# EAGLE schematic SMARTBALL_v3 WIP (EAGLE 9.6.2)
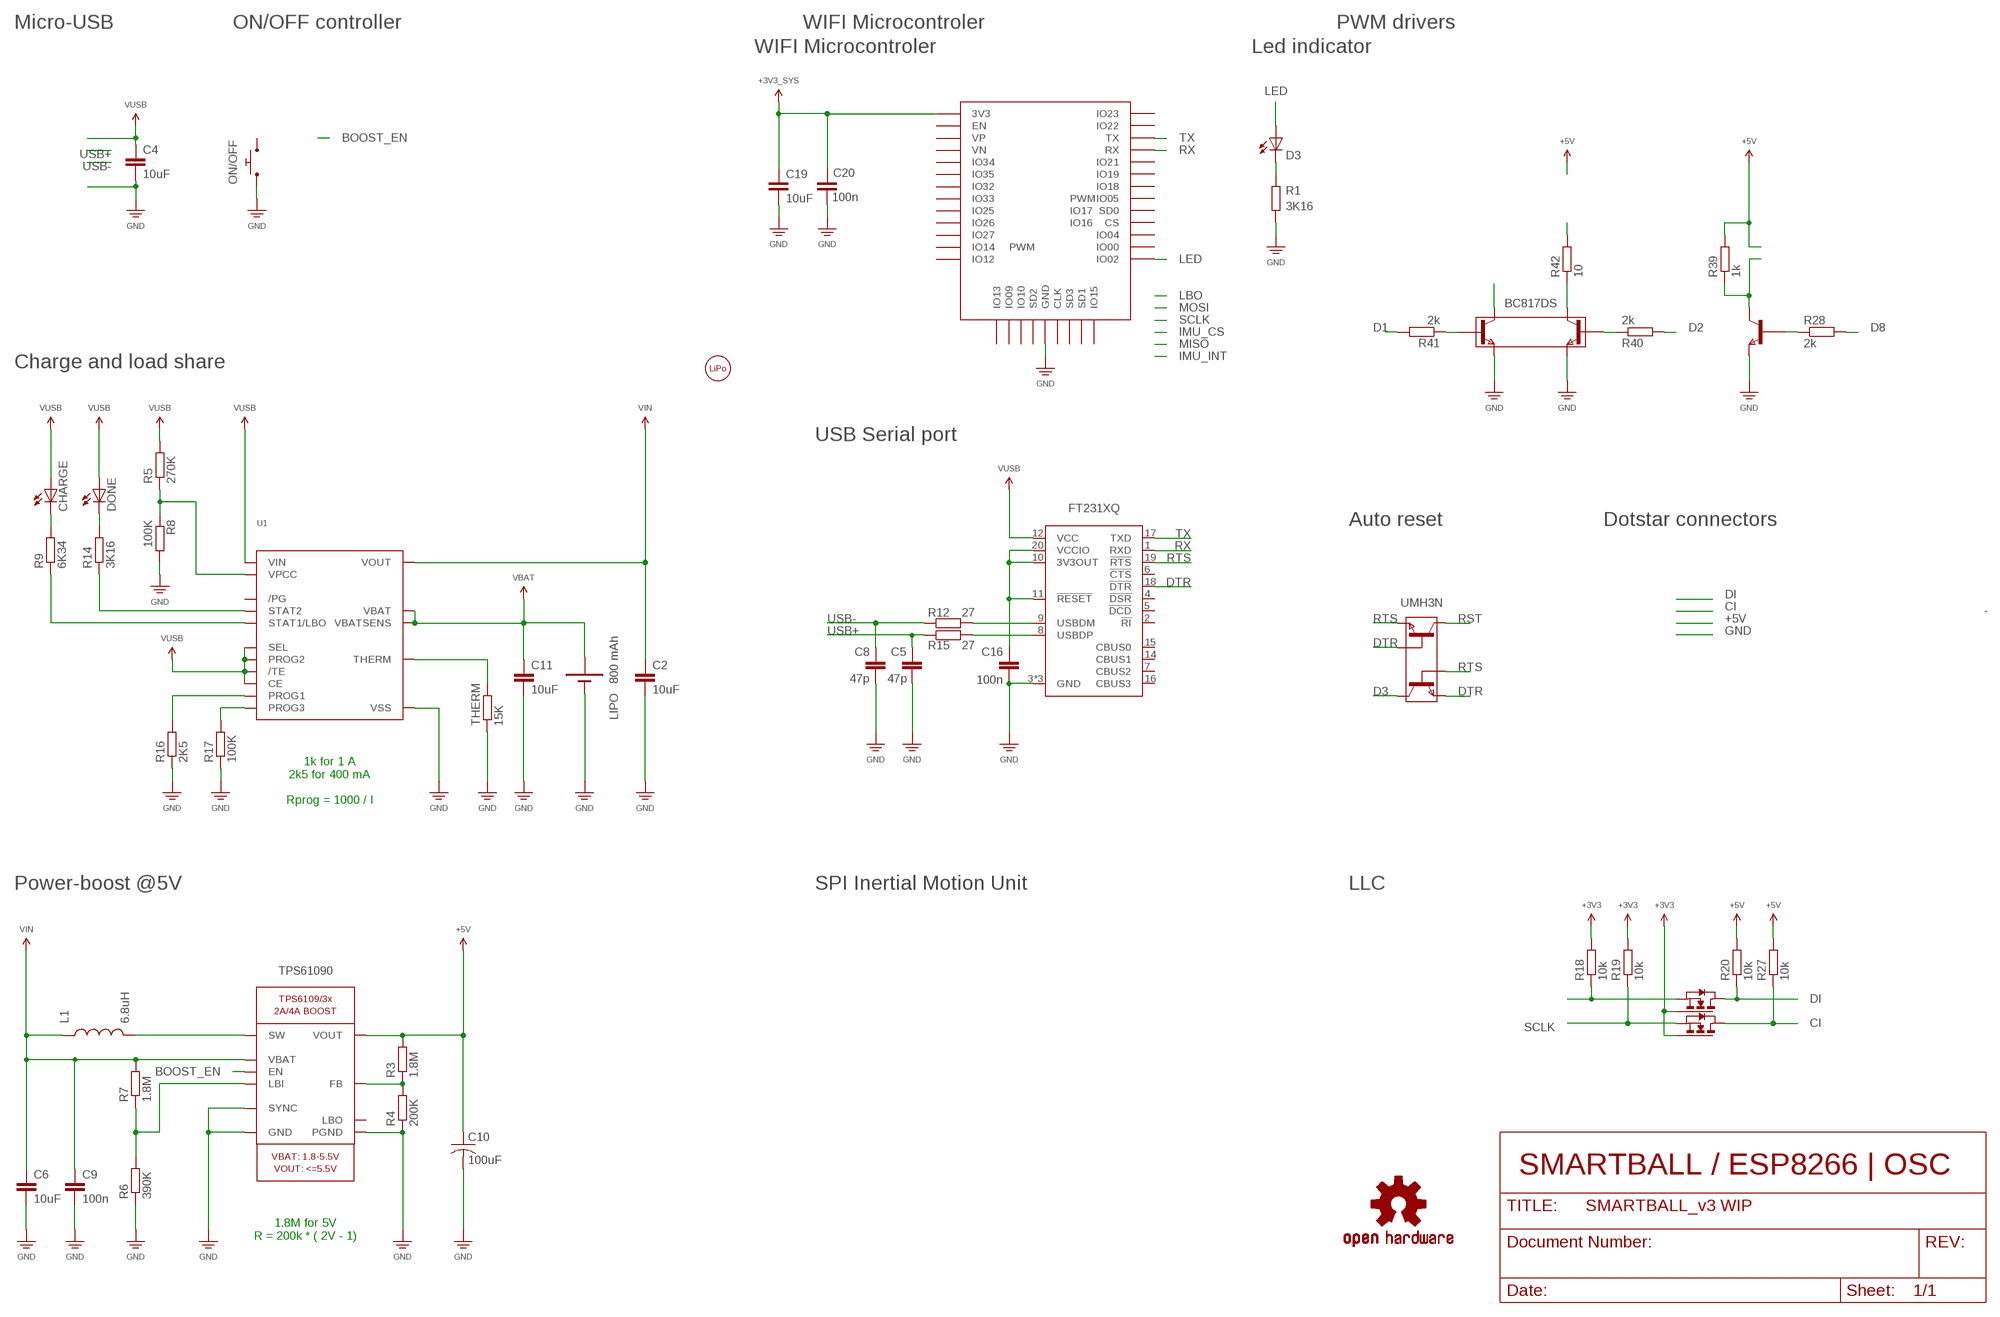
[diagram p0: schematic, sheet 1]

## Parts
BC817DS  SOT_BC817DS  [SOT457R_PHILIPS]
C2  10uF  CAP_CERAMICC0603K  [C0603]
C4  10uF  CAP_CERAMICC0603K  [C0603]
C5  47p  CAP_CERAMICC0603K  [C0603]
C6  10uF  CAP_CERAMICC0603K  [C0603]
C8  47p  CAP_CERAMICC0603K  [C0603]
C9  100n  CAP_CERAMICC0603K  [C0603]
C10  100uF  CAP_TANTALUMC1210  [C1210]
C11  10uF  CAP_CERAMICC0603K  [C0603]
C16  100n  CAP_CERAMICC0603K  [C0603]
C19  10uF  C-EUC0603  [C0603]
C20  100n  C-EUC0603  [C0603]
CHARGE  LED_KINGBRIGHT_16X08  [LED_KINGBRIGHT_16X08]
D3  Blue  LED_KINGBRIGHT_16X08  [LED_KINGBRIGHT_16X08]
DONE  LED_KINGBRIGHT_16X08  [LED_KINGBRIGHT_16X08]
FT231XQ  QFN_FT231X  [QFN20]
L1  6.8uH  IND_ASPIAIG-S4035  [IND_ASPIAIG-S4035]
LIPO  CONN_BATTERY  [CONN_WIRES]
LOGO1  LOGO_OSHWL  [LOGO_OSHW]
ON/OFF  BUT_KMR6  [BUT_KMR6]
R1  3K16  RES_EUR0402  [R0402]
R3  1.8M  RES_EUR0402  [R0402]
R4  200K  RES_EUR0402  [R0402]
R5  270K  RES_EUR0402  [R0402]
R6  390K  RES_EUR0402  [R0402]
R7  1.8M  RES_EUR0402  [R0402]
R8  100K  RES_EUR0402  [R0402]
R9  6K34  RES_EUR0402  [R0402]
R12  27  RES_EUR0402  [R0402]
R14  3K16  RES_EUR0402  [R0402]
R15  27  RES_EUR0402  [R0402]
R16  2K5  RES_EUR0402  [R0402]
R17  100K  RES_EUR0402  [R0402]
R18  10k  RES_EUR0402  [R0402]
R19  10k  RES_EUR0402  [R0402]
R20  10k  RES_EUR0402  [R0402]
R27  10k  RES_EUR0402  [R0402]
R28  2k  RES_EUR0402  [R0402]
R39  1k  RES_EUR0402  [R0402]
R40  2k  RES_EUR0402  [R0402]
R41  2k  RES_EUR0402  [R0402]
R42  10  RES_EUR0402  [R0402]
THERM  15K  RES_EUR0402  [R0402]
TPS61090  TPS61090RSAR  QFN_TPS6103X  [QFN16]
U1  QFN_MCP73871  [QFN20]
U6  ESP-MICRO32  [ESP-MICRO32]
U$22  SOT_2N7002PS  [SOT363]
U$28  SOT_SBC847AWT1G  [SOT323]
U$29  BATT_BODY  [BATT_BODY]
UMH3N  SOT_UMH3N  [SOT363]

## Nets
+3V3 [+3v3]: R18.2 R19.2 U$22.2(G1) U$22.5(G2)
+3V3_SYS [power]: C19.1 C20.1 U6.2(3V3)
+5V [power]: C10.1 R3.2 R20.2 R27.2 R39.2 TPS61090.1(VOUT) TPS61090.15(VOUT) TPS61090.16(VOUT)
B1: BC817DS.5(B2) R41.1
B2: BC817DS.2(B1) R40.1
B3: R28.1 U$28.1(B)
BOOST_EN [power]: TPS61090.11(EN)
C1: BC817DS.3(C2)
C2: BC817DS.6(C1) R42.1
C3: R39.1 U$28.3(C)
CI: R27.1 U$22.3(D2)
D1: R41.2
D2: R40.2
D3: UMH3N.3(C2)
D8: R28.2
DI: R20.1 U$22.6(D1)
DTR: FT231XQ.18(!DTR) UMH3N.2(B1) UMH3N.4(E2)
FB: R3.1 R4.2 TPS61090.14(FB)
GND [power]: BC817DS.1(E1) BC817DS.4(E2) C2.2 C4.2 C5.2 C6.2 C8.2 C9.2 C10.2 C11.2 C16.2 C19.2 C20.2 FT231XQ.3(GND) FT231XQ.13(GND) FT231XQ.EXP(GND) LIPO.GND ON/OFF.1 ON/OFF.4 R1.1 R4.1 R6.1 R8.2 R16.1 R17.1 THERM.1 TPS61090.5(PGND) TPS61090.6(PGND) TPS61090.7(PGND) TPS61090.10(SYNC) TPS61090.13(GND) TPS61090.PAD(PGND) U1.10(VSS) U1.11(VSS) U1.EXP(VSS) U6.1(GND) U6.15(GND) U6.38(GND) U$28.2(E)
LBI: R6.2 R7.1 TPS61090.9(LBI)
LED: D3.1(A) U6.24(IO02)
LED1: DONE.2(C) R14.2
LED2: CHARGE.2(C) R9.2
LED3: D3.2(C) R1.2
MOT: R42.2
PROG1: R16.2 U1.13(PROG1)
PROG3: R17.2 U1.12(PROG3)
RST: UMH3N.6(C1)
RTS: FT231XQ.19(!RTS) UMH3N.1(E1) UMH3N.5(B2)
RX: FT231XQ.1(RXD) U6.34(RX)
SCLK: R19.1 U$22.4(S2)
STAT1: R9.1 U1.8(STAT1/LBO)
STAT2: R14.1 U1.7(STAT2)
SW: L1.2 TPS61090.3(SW) TPS61090.4(SW)
THERM: THERM.2 U1.5(THERM)
TX: FT231XQ.17(TXD) U6.35(TX)
USB+: C5.1 R15.1
USB-: C8.1 R12.1
USBDM: FT231XQ.9(USBDM) R12.2
USBDP: FT231XQ.8(USBDP) R15.2
VBAT [power]: C11.1 LIPO.VCC(VBAT) U1.14(VBAT) U1.15(VBAT) U1.16(VBATSENS)
VCCIO1: C16.1 FT231XQ.10(3V3OUT) FT231XQ.11(!RESET) FT231XQ.20(VCCIO)
VIN [power]: C2.1 C6.1 C9.1 L1.1 R7.2 TPS61090.8(VBAT) U1.1(VOUT) U1.20(VOUT)
VPCC: R5.1 R8.1 U1.2(VPCC)
VUSB [power]: C4.1 CHARGE.1(A) DONE.1(A) FT231XQ.12(VCC) R5.2 U1.3(SEL) U1.4(PROG2) U1.9(/TE) U1.17(CE) U1.18(VIN) U1.19(VIN)
Y0: R18.1 U$22.1(S1)
Unconnected: FT231XQ.2(!RI) FT231XQ.4(!DSR) FT231XQ.5(!DCD) FT231XQ.6(!CTS) FT231XQ.7(CBUS2) FT231XQ.14(CBUS1) FT231XQ.15(CBUS0) FT231XQ.16(CBUS3) ON/OFF.2 ON/OFF.3 TPS61090.12(LBO) U1.6(/PG) U6.3(EN) U6.4(VP) U6.5(VN) U6.6(IO34) U6.7(IO35) U6.8(IO32) U6.9(IO33) U6.10(IO25) U6.11(IO26) U6.12(IO27) U6.13(IO14) U6.14(IO12) U6.16(IO13) U6.17(IO09) U6.18(IO10) U6.19(SD2) U6.20(CLK) U6.21(SD3) U6.22(SD1) U6.23(IO15) U6.25(IO00) U6.26(IO04) U6.27(CS) U6.28(SD0) U6.29(IO05) U6.30(IO18) U6.31(IO19) U6.33(IO21) U6.36(IO22) U6.37(IO23)

## Notes on the sheet
- Micro-USB | ON/OFF controller | WIFI Microcontroler | PWM drivers
- WIFI Microcontroler | Led indicator
- PWM
- IO17
- IO16
- PWM
- Charge and load share
- USB Serial port
- Auto reset | Dotstar connectors
- 800 mAh
- 1k for 1 A
  2k5 for 400 mA
  
  Rprog = 1000 / I
- Power-boost @5V | SPI Inertial Motion Unit | LLC
- SMARTBALL / ESP8266 | OSC
- 1.8M for 5V
  R = 200k * ( 2V - 1)

## Library data of the parts
BC817DS = Smartball:SOT_BC817DS: Dual NPN Transistor
C2 C4-C6 C8 C9 C11 C16 = Smartball:CAP_CERAMIC: Ceramic Capacitor; SPICEPREFIX: C
C10 = Smartball:CAP_TANTALUM: Tantalum Capacitor
C19 C20 = Maestro:C-EU: CAPACITOR, European symbol
CHARGE D3 DONE = Smartball:LED_KINGBRIGHT_16X08: SMD Color LED
FT231XQ = Smartball:QFN_FT231X: Serial USB Interface
L1 = Smartball:IND_ASPIAIG-S4035: Inductor
LIPO = Smartball:CONN_BATTERY: LIPO PCB Connector
LOGO1 = Smartball:LOGO_OSHW: Open-Source Hardware (OSHW) Logo This logo indicates the piece of hardware it is found on incorporates a OSHW license and/or adheres to the definition of open source hardware found here: http://freedomdefined.org/OSHW
ON/OFF = Smartball:BUT_KMR6: Momentary Switch
R1 R3-R9 R12 R14-R20 R27 R28 R39-R42 THERM = Smartball:RES_EU: Resistor; SPICEPREFIX: R
TPS61090 = Smartball:QFN_TPS6103X: Power Booster 1.8-5.5V Input, Adjustable Output to 5.5V
U1 = Smartball:QFN_MCP73871: Lithium Polymer Battery Charger
U6 = myComponents:ESP-MICRO32: LilyGo Micro32
U$22 = Smartball:SOT_2N7002PS
U$28 = Smartball:SOT_SBC847AWT1G: NPN Transistor
U$29 = Smartball:BATT_BODY: Battery Body
UMH3N = Smartball:SOT_UMH3N: Autoreset dual-channel NPN Transistor

## Net classes
0 default: width 0.152 mm
1 power: width 0.254 mm
2 +3v3: width 0.203 mm